# EAGLE design ATTAMI-Shield-tinyISP (EAGLE 7.1.0)
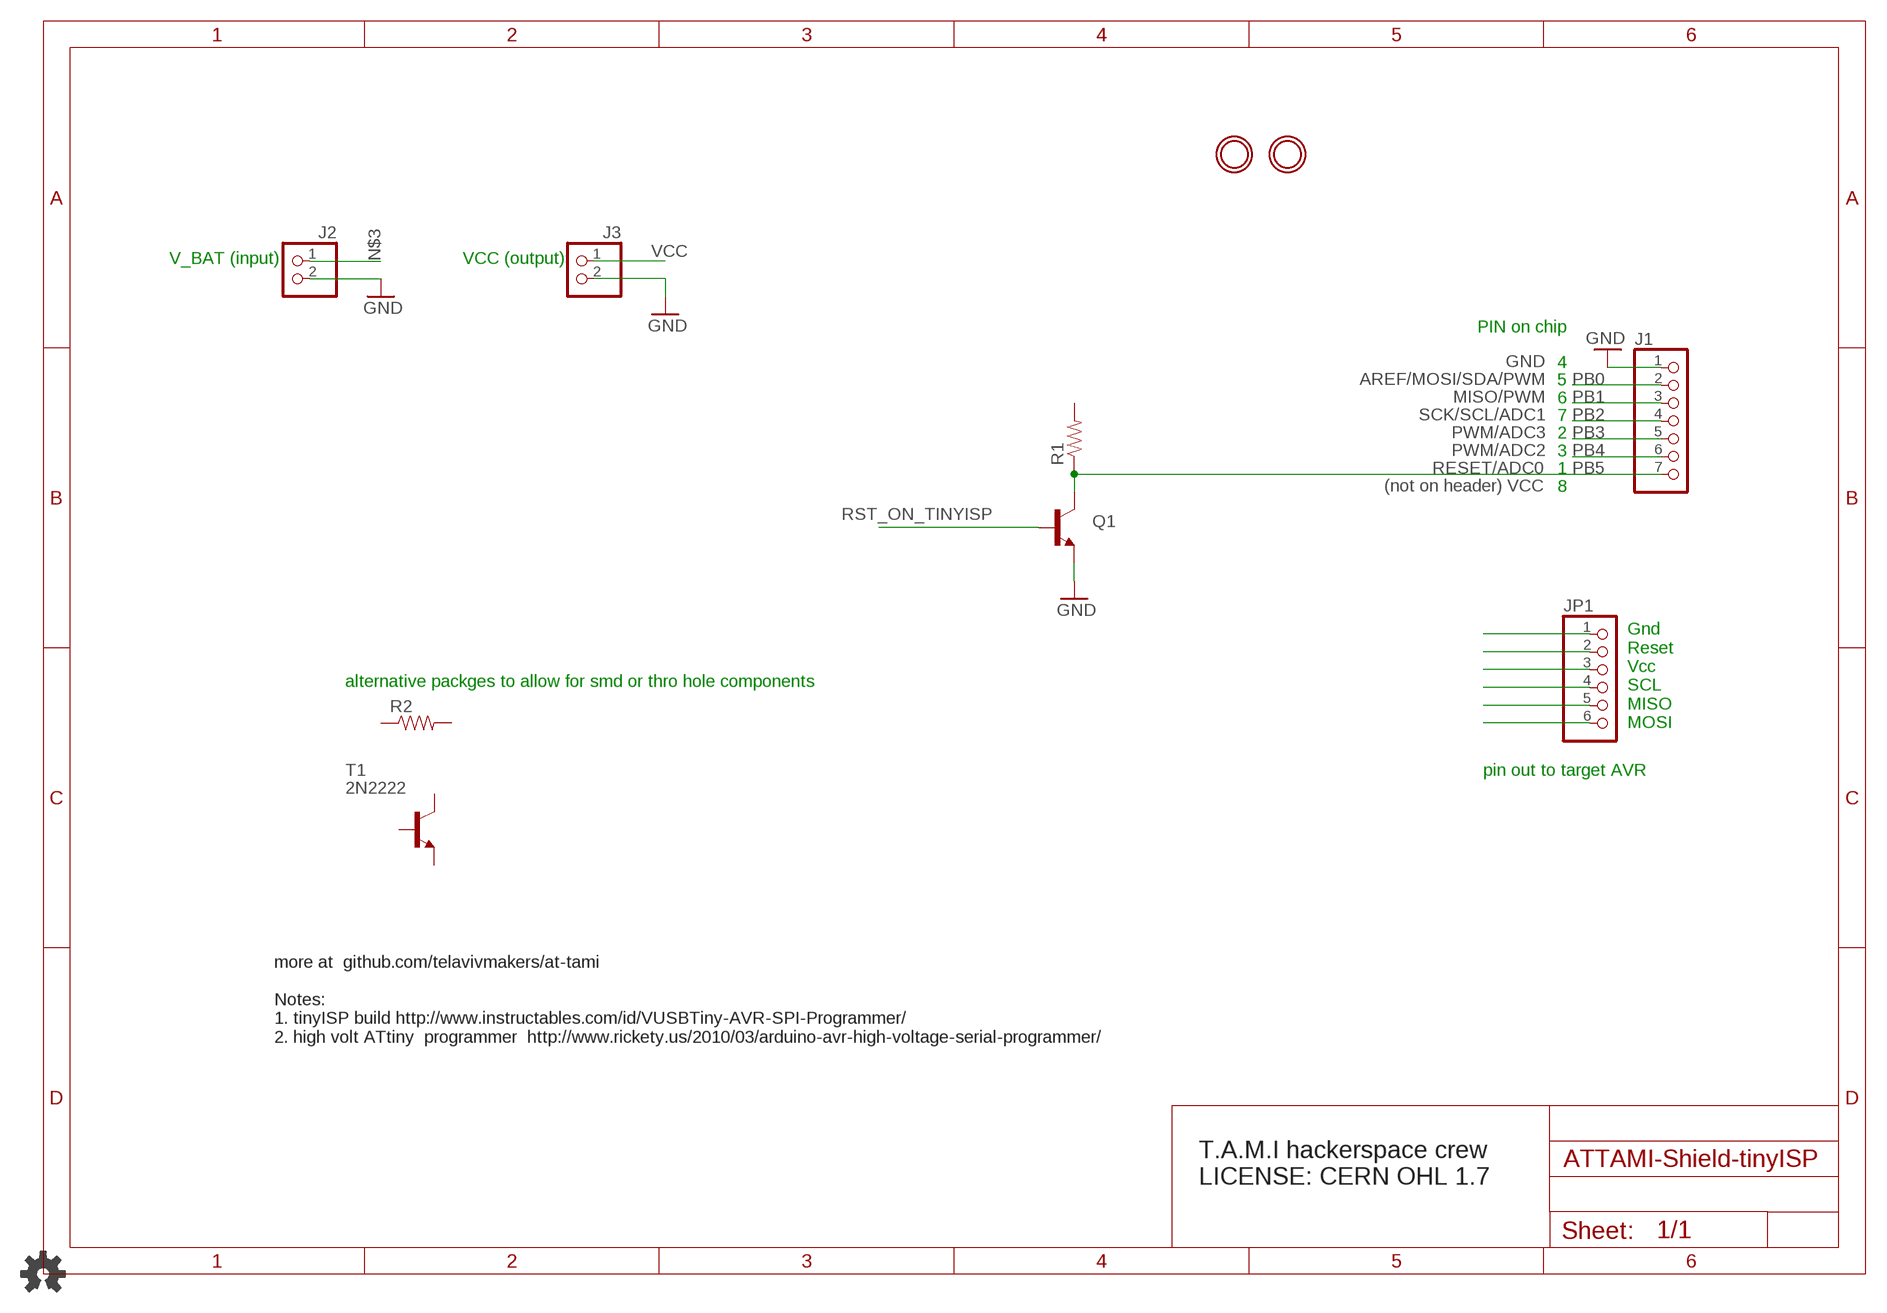
[diagram p0: schematic, sheet 1]

## Parts
J1  HEADER-1X7ROUND  [1X07_ROUND]
J2  HEADER-1X2ROUND  [1X02_ROUND]
J3  HEADER-1X2ROUND  [1X02_ROUND]
JP1  HEADER-1X6ROUND  [1X06_ROUND]
Q1  TRANSISTOR_NPNSOT23  [SOT23]
R1  RESISTOR0805-RES  [0805]
R2  RESISTORAXIAL-0.3  [AXIAL-0.3]
T1  2N2222  [TO92-EBC-OVAL]
U$1  MOUNTINGHOLE2.0  [MOUNTINGHOLE_2.0_PLATED]
U$2  MOUNTINGHOLE2.0  [MOUNTINGHOLE_2.0_PLATED]

## Nets
GND: J1.1 J2.2 J3.2 Q1.2(E)
N$1: JP1.1
N$3: J2.1
N$4: JP1.2
N$5: JP1.3
N$6: JP1.4
N$7: JP1.5
N$8: JP1.6
PB0: J1.2
PB1: J1.3
PB2: J1.4
PB3: J1.5
PB4: J1.6
PB5: J1.7 Q1.3(C) R1.1
RST_ON_TINYISP: Q1.1(B)
VCC: J3.1
Unconnected: R1.2 R2.P$1 R2.P$2 T1.B T1.C T1.E

## Notes on the sheet
- V_BAT (input) | VCC (output)
- GND
- AREF/MOSI/SDA/PWM
- MISO/PWM
- SCK/SCL/ADC1
- PWM/ADC3
- PWM/ADC2
- RESET/ADC0
- (not on header) VCC
- PIN on chip
  
  4
  5
  6
  7
  2
  3
  1
  8
- alternative packges to allow for smd or thro hole components
- Gnd
  Reset
  Vcc
  SCL
  MISO
  MOSI
- pin out to target AVR
- more at  github.com/telavivmakers/at-tami
  
  Notes: 
  1. tinyISP build http://www.instructables.com/id/VUSBTiny-AVR-SPI-Programmer/
  2. high volt ATtiny  programmer  http://www.rickety.us/2010/03/arduino-avr-high-voltage-serial-programmer/
- T.A.M.I hackerspace crew 
  LICENSE: CERN OHL 1.7

## Library data of the parts
J1 = microbuilder:HEADER-1X7: PIN HEADER
J2 J3 = microbuilder:HEADER-1X2: PIN HEADER
JP1 = ATtami:HEADER-1X6: PIN HEADER
Q1 = SparkFun-DiscreteSemi:TRANSISTOR_NPN: Generic NPN BJT MMBT2222A - TRANS-08049 (SOT-23, 1A 40V) MPSA42 - TRANS-09116 (SOT-23, 500mA 300V) MMBT5088LT1G - TRANS-11160 (SOT-23, 50 mA 30V)
R1 = ATtami:RESISTOR: Resistor Basic schematic elements and footprints for 0603, 1206, and PTH resistors.
R2 = SparkFun-Resistors:RESISTOR: Resistor Basic schematic elements and footprints for 0603, 1206, and PTH resistors.
T1 = adafruit:2N2222: NPN TRANSISTOR Big oval pads
U$1 U$2 = microbuilder:MOUNTINGHOLE: Mounting Hole For #2 screws (0.086"/2.18mm width, 0.094"/2.4mm hole) use 2.5mm

## Net classes
0 default: width 0.203 mm
1 vcc: width 0.254 mm

## Board
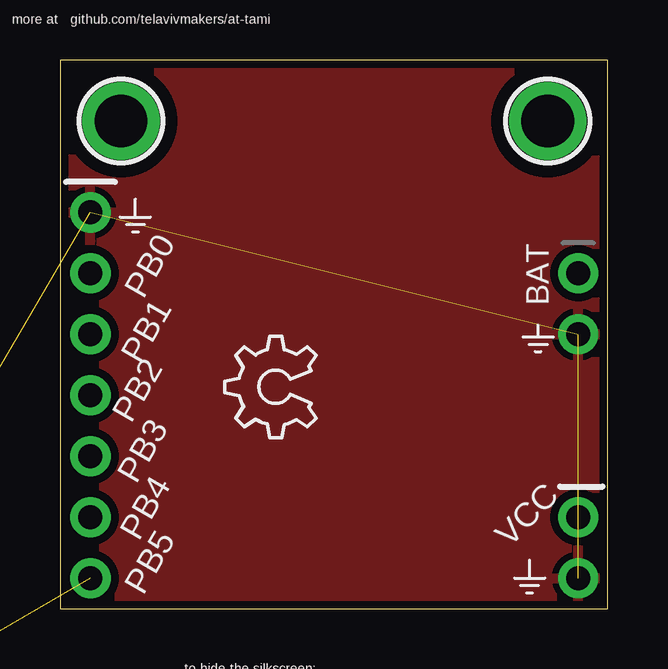
[diagram p1: board, top side]
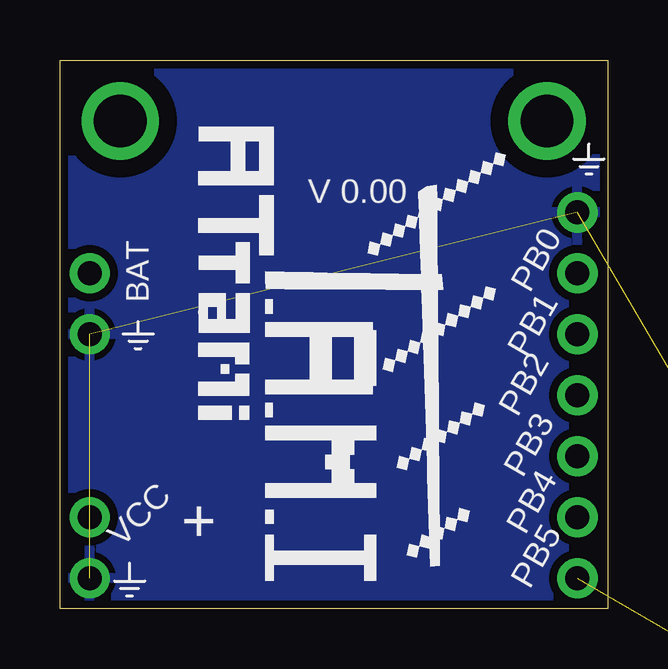
[diagram p2: board, bottom side, seen from below]

Size 22.83 x 22.86 mm. Coordinates in mm from the lower left corner, seen from the top.
Outline: 0,0 22.83,0 22.83,22.86 0,22.86 0,0
Copper layers (1*16): Top 0.035mm / dielectric 1.5mm / Bottom 0.035mm
Design rules "dirt_cheap_dirty_boards.v1": minimum track width 5mil, minimum drill 12mil, track to track 5mil, track to pad 5mil, pad to pad 5mil, via to via 5mil, smd to smd 0mil, copper to edge 10mil, drill to drill 10mil, minimum pad ring 10mil, minimum via ring 6mil, stop-mask expansion 2mil, vias tented up to drill 25mil, thermal gap 10mil

### Footprints (pad centres in the part's own frame; a part is rotated, then mirrored left to right if it is on the bottom)
1X07_ROUND = drill 1 pad 1.676: 1 -7.62,0; 2 -5.08,0; 3 -2.54,0; 4 0,0; 5 2.54,0; 6 5.08,0; 7 7.62,0
1X02_ROUND = drill 1 pad 1.676: 1 -1.27,0; 2 1.27,0
1X06_ROUND = drill 1 pad 1.676: 1 -6.35,0; 2 -3.81,0; 3 -1.27,0; 4 1.27,0; 5 3.81,0; 6 6.35,0
SOT23 = smd 1 x 1.4: 1 -0.95,-1.1; 2 0.95,-1.1; 3 0,1.1
0805 = smd 0.8 x 1.2: 1 -0.9,0; 2 0.9,0
AXIAL-0.3 = drill 0.9 pad 1.88: P$1 -3.81,0; P$2 3.81,0
TO92-EBC-OVAL = drill 0.813 long: B 0,-1.27; C 2.54,-1.27; E -2.54,-1.27
MOUNTINGHOLE_2.0_PLATED = drill 2.2 pad 3: P$1 0,0

### Placement (x,y rotation side)
J1  1.27,8.89 270 top
J2  21.59,12.7 270 top
J3  21.59,2.54 270 top
JP1  3.94,-6.48 0 top  (outside the outline)
Q1  -15.62,-9.65 0 top  (outside the outline)
R1  -18.54,-9.65 0 top  (outside the outline)
R2  -14.99,-13.46 0 top  (outside the outline)
T1  -10.54,-6.48 0 top  (outside the outline)
U$1  2.54,20.32 270 top
U$2  20.32,20.32 0 top
U$3  [OSHW_6X150_NOTEXT]  10.67,7.11 90 top

### Tracks (layer width: path | path; a pad name or v marks a point on that pad's centre or on a via)
GND  (3 unrouted)
  pour Bottom (isolate 0.33): 23.37,23.75 -1.52,23.62 -1.21,-1.43 23.37,-1.02
  pour Top (isolate 0.33): -1.02,23.5 -1.02,-0.51 23.62,-0.51 23.3,23.53
PB5  (2 unrouted)

### Text on the board
tPlace: more at github.com/telavivmakers/at-tami | to hide the silkscreen: / disable layers: tNames, bNames, tPlace, bPlace
bPlace: V 0.00 | BAT | PB0 | PB1 | PB2 | PB3 | PB4 | + | VCC | PB5
tNames: BAT | PB0 | PB1 | PB2 | PB3 | PB4 | VCC | PB5
tTest: J2